# EAGLE design expander16 (EAGLE 6.1)
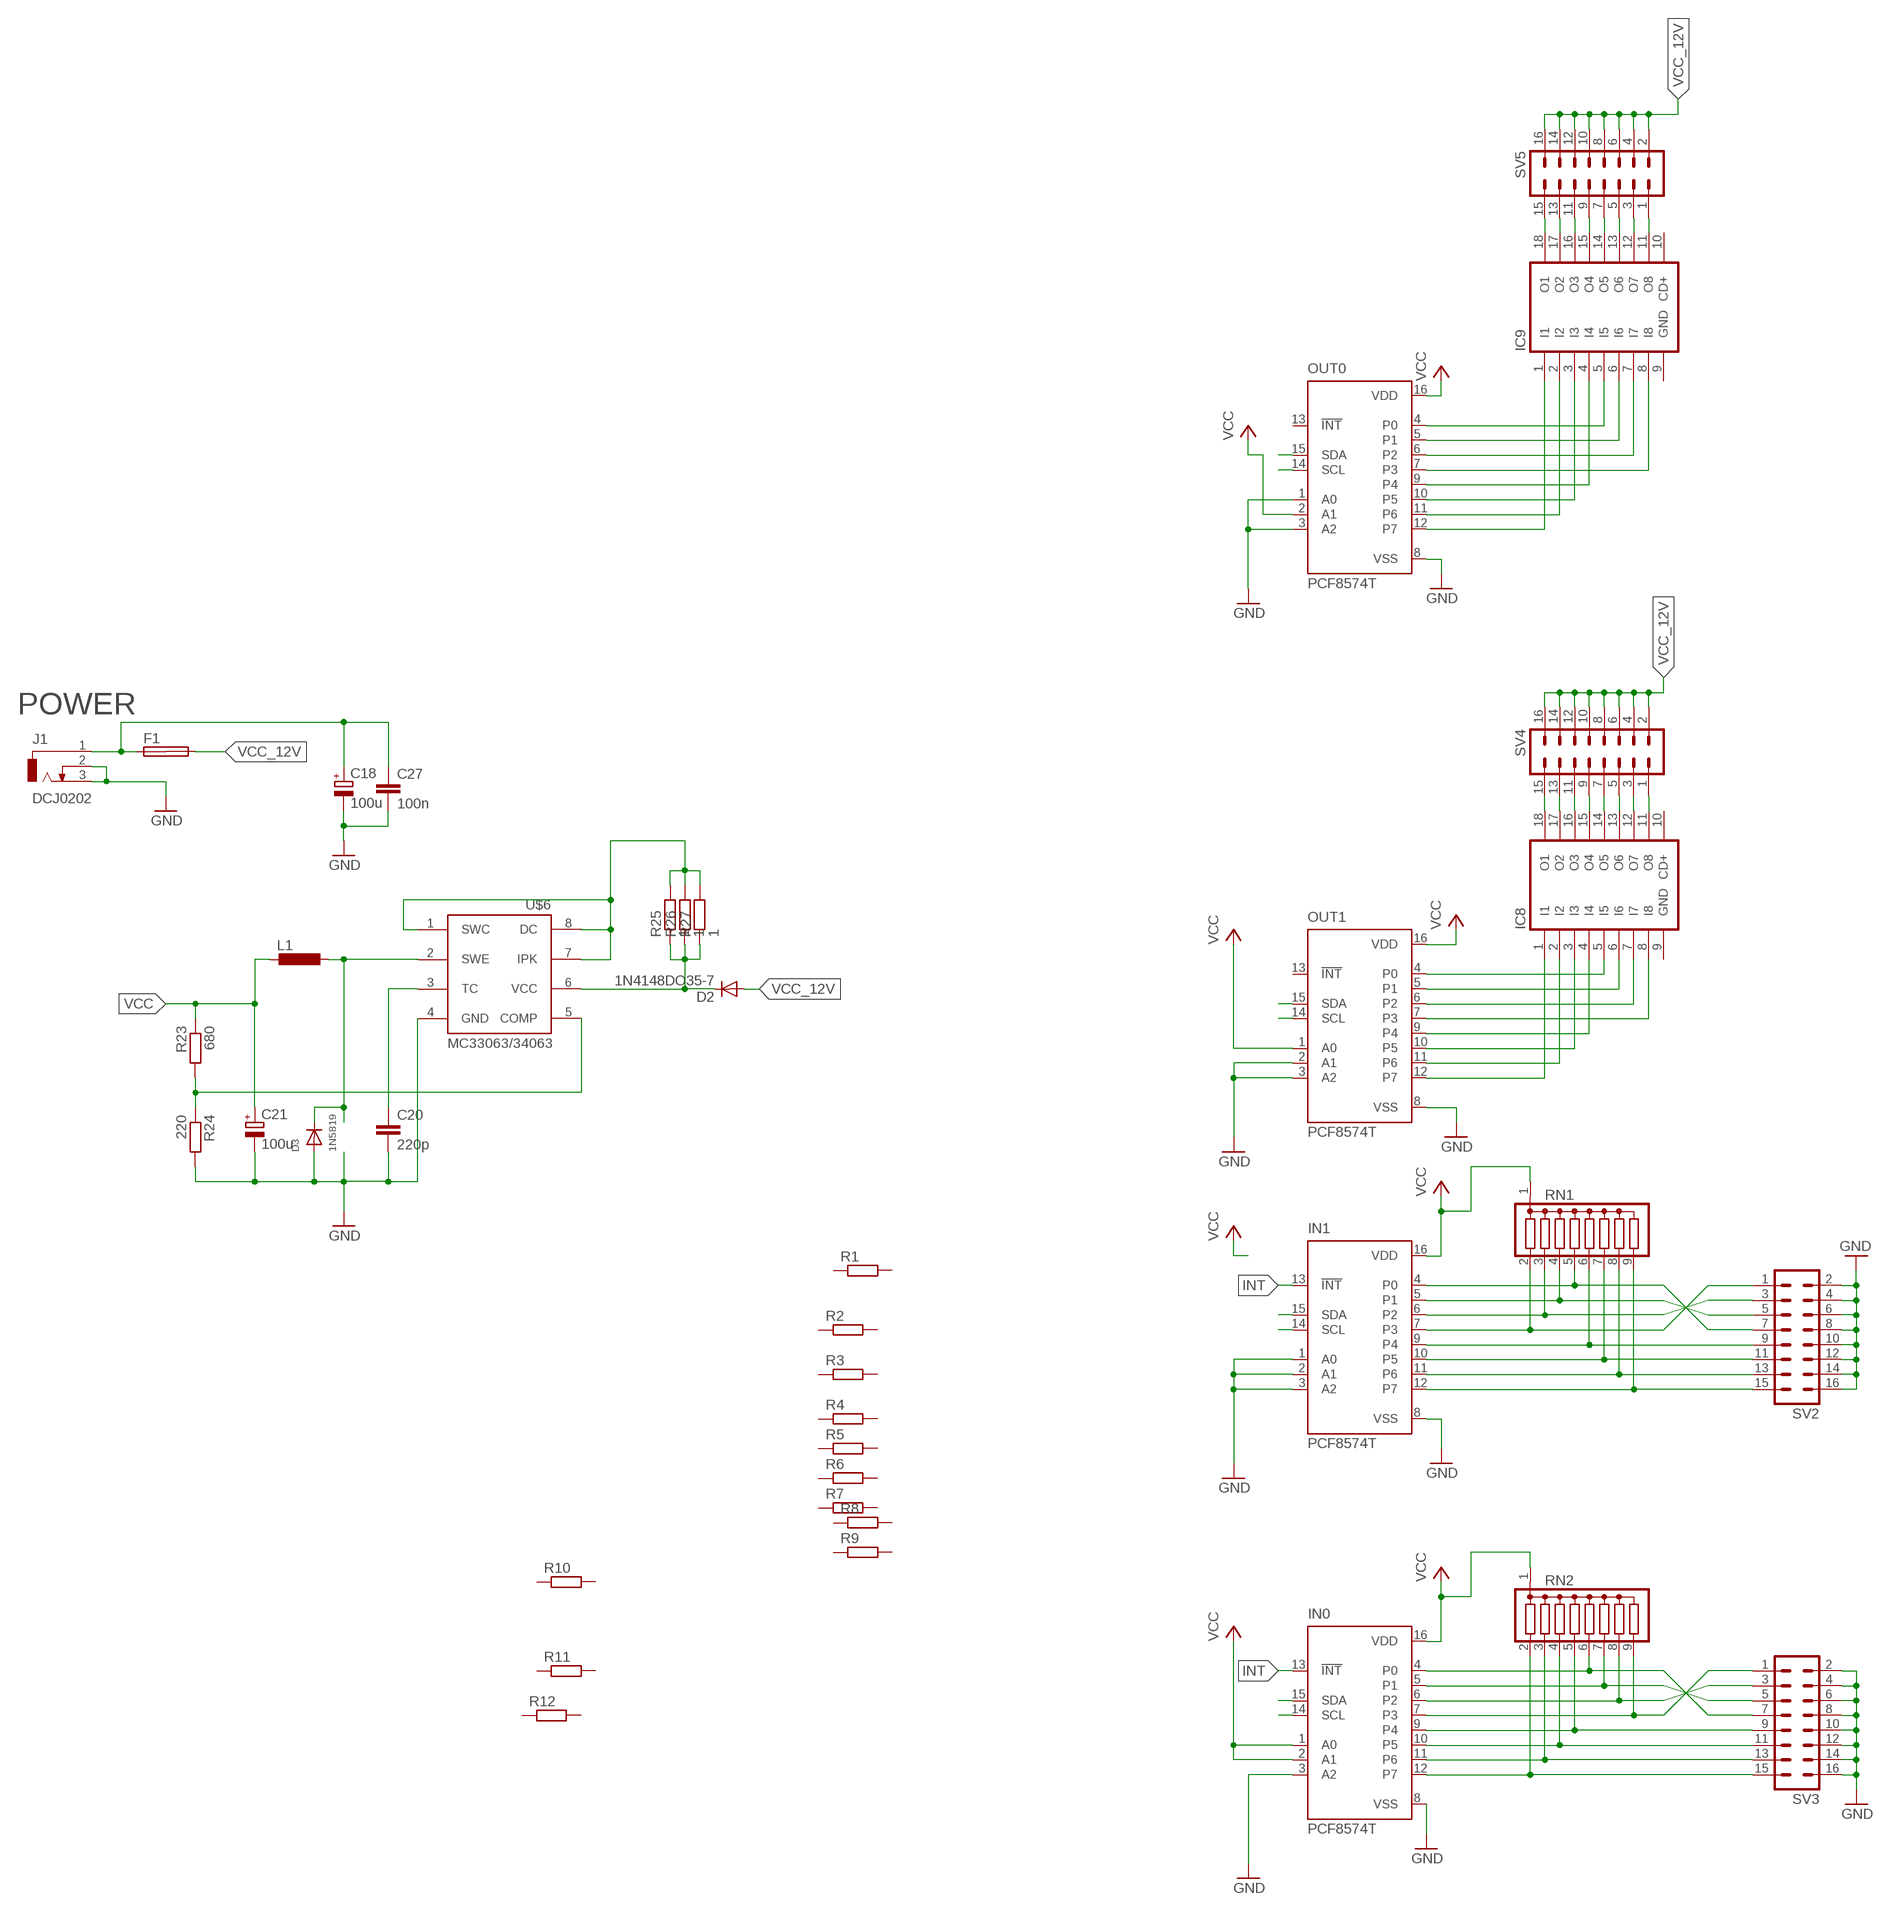
[diagram p0: schematic, sheet 1, part 1 of 3]
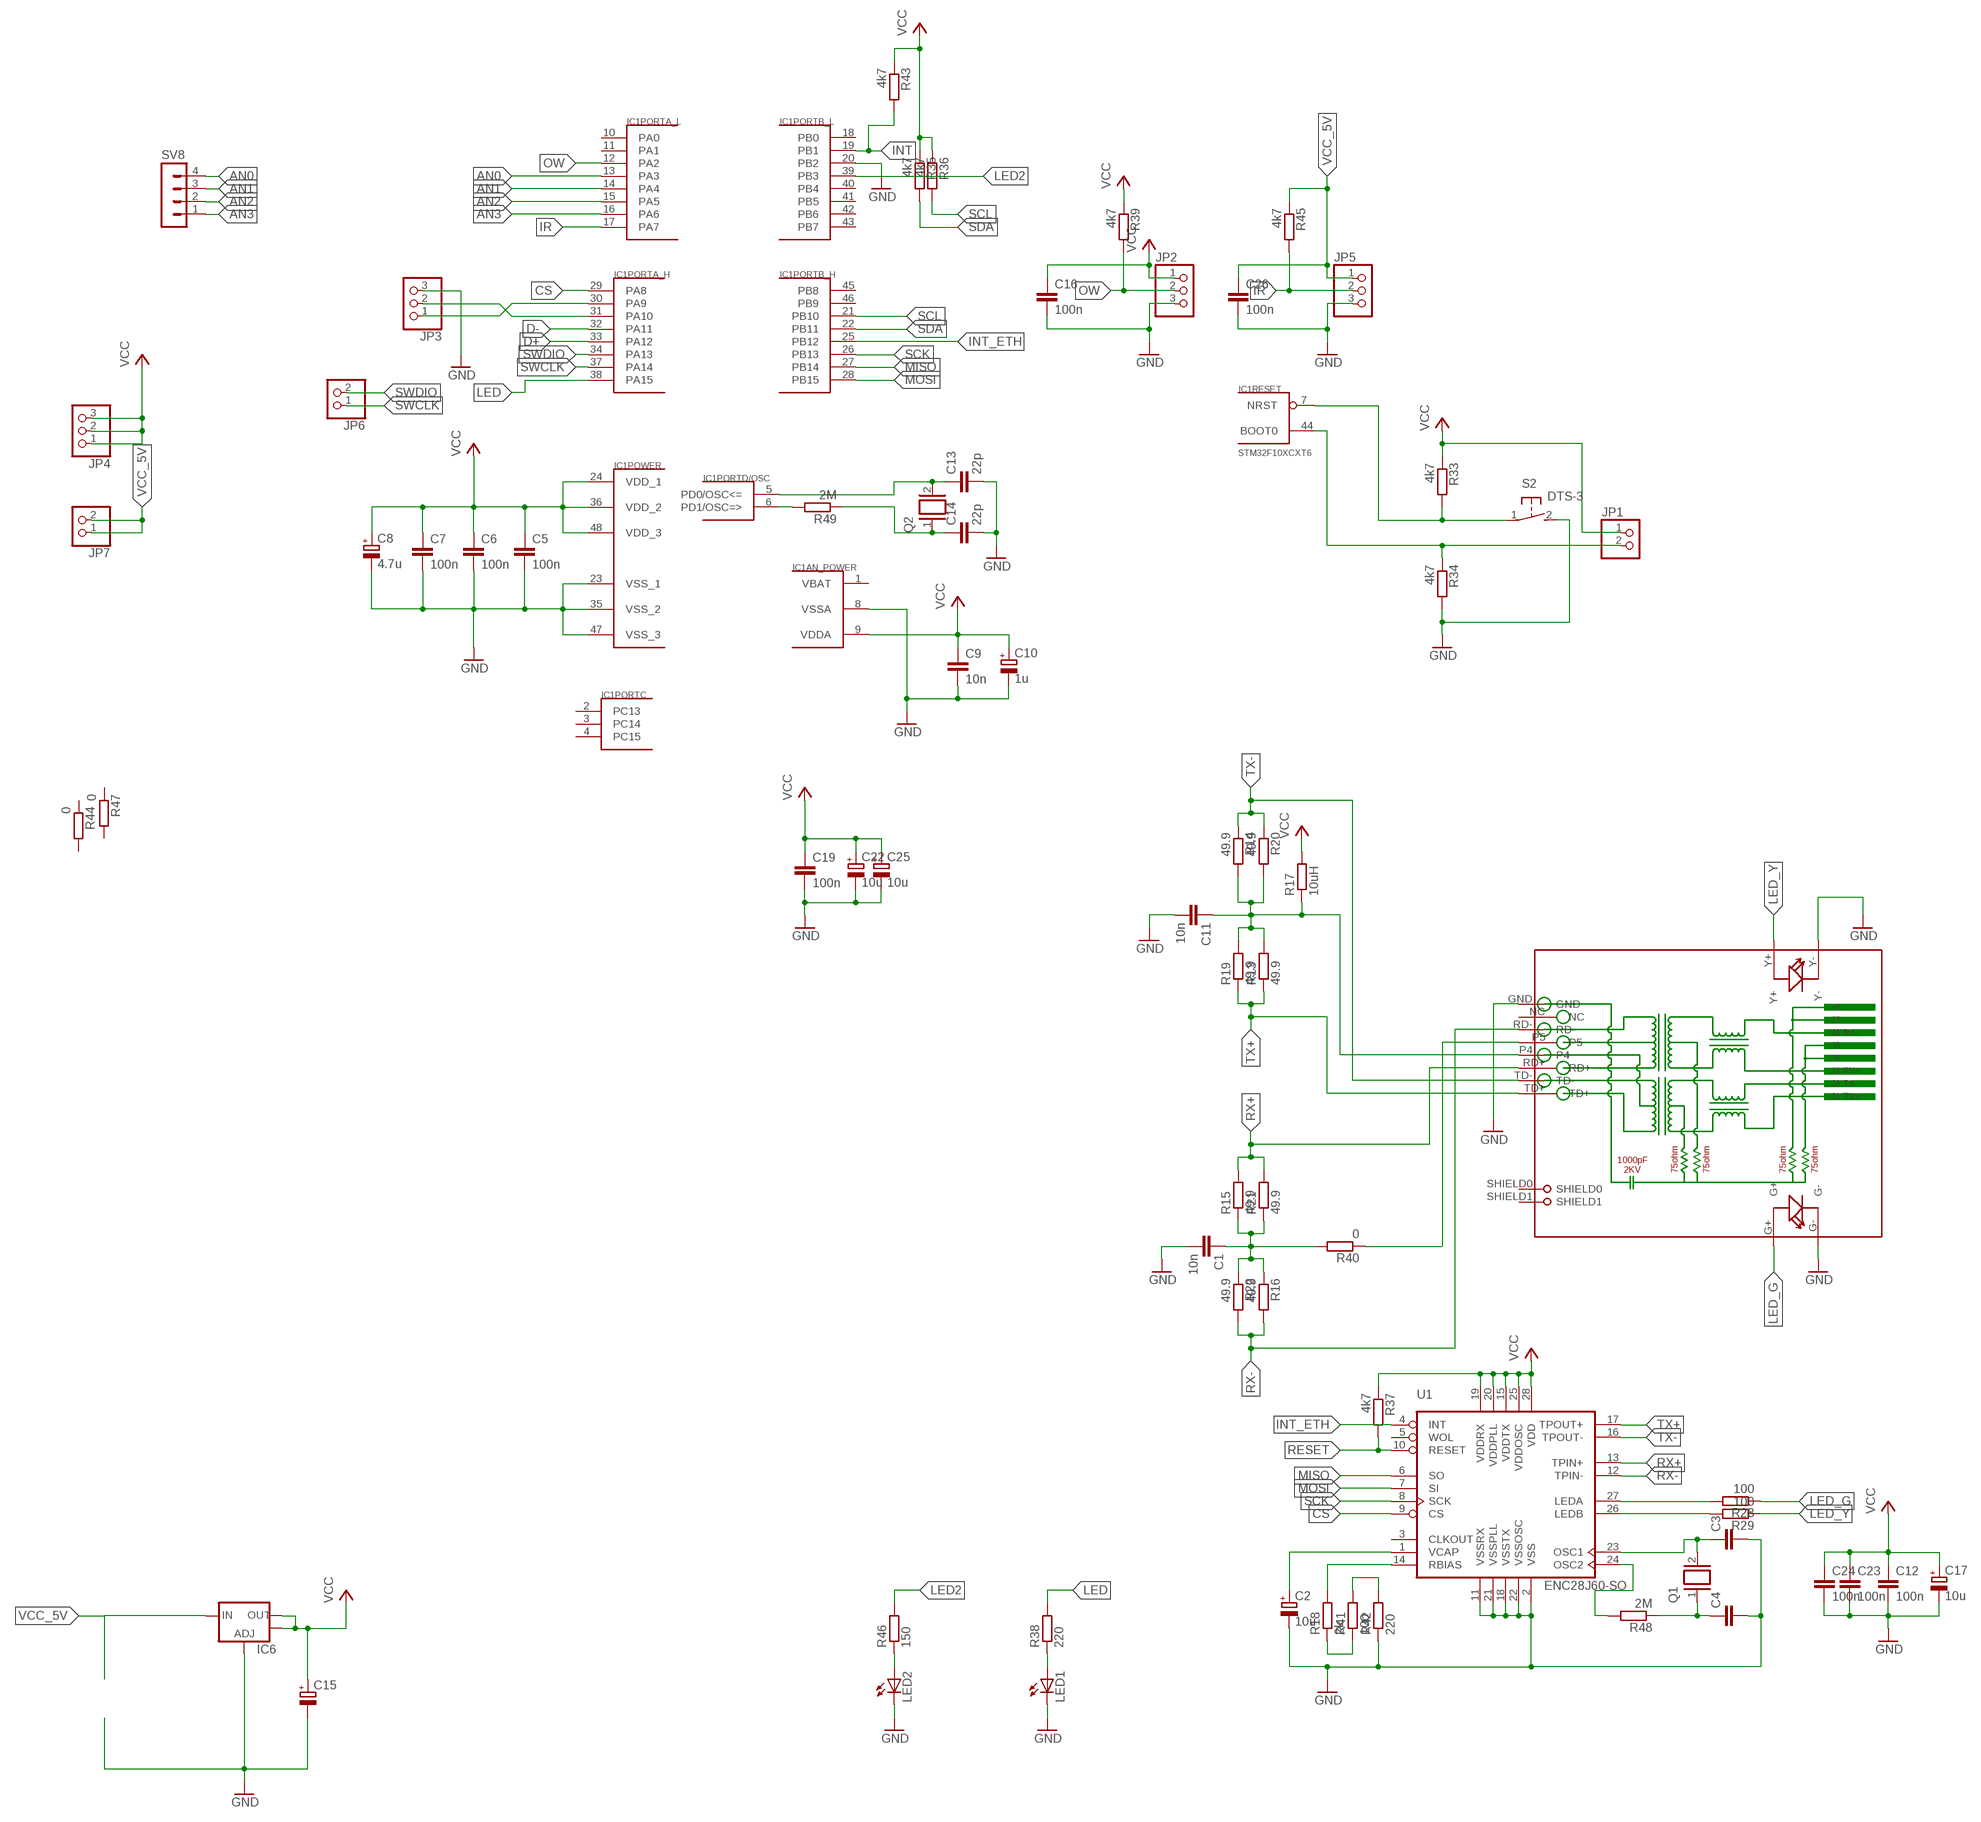
[diagram p1: schematic, sheet 1, part 2 of 3]
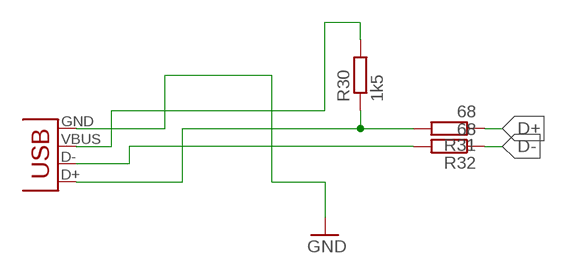
[diagram p2: schematic, sheet 1, part 3 of 3]

## Parts
C1  10n  C-EUC0805  [C0805]
C2  10u  CPOL-EUB/3528-21W  [B/3528-21W]
C3  C-EUC0805  [C0805]
C4  C-EUC0805  [C0805]
C5  100n  C-EUC0805  [C0805]
C6  100n  C-EUC0805  [C0805]
C7  100n  C-EUC0805  [C0805]
C8  4.7u  CPOL-EU153CLV-0505  [153CLV-0505]
C9  10n  C-EUC0805  [C0805]
C10  1u  CPOL-EU153CLV-0505  [153CLV-0505]
C11  10n  C-EUC1206  [C1206]
C12  100n  C-EUC0805  [C0805]
C13  22p  C-EUC0805  [C0805]
C14  22p  C-EUC0805  [C0805]
C15  CPOL-EUA/3216-18R  [A/3216-18R]
C16  100n  C-EUC1206  [C1206]
C17  10u  CPOL-EUE1.8-4  [E1,8-4]
C18  100u  CPOL-EUE2.5-7  [E2,5-7]
C19  100n  C-EUC0805  [C0805]
C20  220p  C-EUC0805  [C0805]
C21  100u  CPOL-EUE3.5-8  [E3,5-8]
C22  10u  CPOL-EUE1.8-4  [E1,8-4]
C23  100n  C-EUC0805  [C0805]
C24  100n  C-EUC0805  [C0805]
C25  10u  CPOL-EUE1.8-4  [E1,8-4]
C26  100n  C-EUC1206  [C1206]
C27  100n  C-EUC0805  [C0805]
D2  1N4148DO35-7  [DO35-7]
D3  1N5819  DIODESMA  [SMADIODE]
F1  SHK20L  [SHK20L]
IC1  STM32F10XCXT6  [TQFP48]
IC6  V_REG_LM1117SOT223  [SOT223]
IC8  ULN2803AD  [SO18W]
IC9  ULN2803AD  [SO18W]
IN0  PCF8574T  [SO16W]
IN1  PCF8574T  [SO16W]
J1  DCJ0202  [DCJ0202]
JP1  PINHD-1X2  [1X02]
JP2  PINHD-1X3  [1X03]
JP3  PINHD-1X3  [1X03]
JP4  PINHD-1X3  [1X03]
JP5  PINHD-1X3  [1X03]
JP6  PINHD-1X2  [1X02]
JP7  PINHD-1X2  [1X02]
L1  L-EU0207/5V  [0207/5V]
LED1  LEDCHIPLED_0805  [CHIPLED_0805]
LED2  LED3MM  [LED3MM]
OUT0  PCF8574T  [SO16W]
OUT1  PCF8574T  [SO16W]
Q1  XTAL/S  [QS]
Q2  XTAL/S  [QS]
R1  R-EU_R1206  [R1206]
R2  R-EU_R1206  [R1206]
R3  R-EU_R1206  [R1206]
R4  R-EU_R1206  [R1206]
R5  R-EU_R1206  [R1206]
R6  R-EU_R1206  [R1206]
R7  R-EU_R1206  [R1206]
R8  R-EU_R1206  [R1206]
R9  R-EU_R1206  [R1206]
R10  R-EU_R1206  [R1206]
R11  R-EU_R1206  [R1206]
R12  R-EU_R1206  [R1206]
R13  49.9  R-EU_R1206  [R1206]
R14  49.9  R-EU_R0805  [R0805]
R15  49.9  R-EU_R1206  [R1206]
R16  49.9  R-EU_R0805  [R0805]
R17  10uH  R-EU_0204/5  [0204/5]
R18  2k  R-EU_R0805  [R0805]
R19  49.9  R-EU_R1206  [R1206]
R20  49.9  R-EU_R0805  [R0805]
R21  49.9  R-EU_R1206  [R1206]
R22  49.9  R-EU_R0805  [R0805]
R23  680  R-EU_M1206  [M1206]
R24  220  R-EU_M1206  [M1206]
R25  1  R-EU_R0805  [R0805]
R26  1  R-EU_R0805  [R0805]
R27  1  R-EU_R0805  [R0805]
R28  100  R-EU_R1206  [R1206]
R29  100  R-EU_R1206  [R1206]
R30  1k5  R-EU_M0805  [M0805]
R31  68  R-EU_M1206  [M1206]
R32  68  R-EU_M1206  [M1206]
R33  4k7  R-EU_R0805  [R0805]
R34  4k7  R-EU_R0805  [R0805]
R35  4k7  R-EU_R0805  [R0805]
R36  4k7  R-EU_R1206  [R1206]
R37  4k7  R-EU_R0805  [R0805]
R38  220  R-EU_R0805  [R0805]
R39  4k7  R-EU_R0805  [R0805]
R40  0  R-EU_R0805  [R0805]
R41  100  R-EU_R0805  [R0805]
R42  220  R-EU_R0805  [R0805]
R43  4k7  R-EU_R0805  [R0805]
R44  0  R-EU_R1206  [R1206]
R45  4k7  R-EU_R0805  [R0805]
R46  150  R-EU_R0805  [R0805]
R47  0  R-EU_R1206  [R1206]
R48  2M  R-EU_R0805  [R0805]
R49  2M  R-EU_R0805  [R0805]
RJ1  HR911105A  [HR911105A]
RN1  G08R  [SIL9]
RN2  G08R  [SIL9]
S2  DTS-3  [DTS-3]
SV2  MA08-2W  [MA08-2W]
SV3  MA08-2W  [MA08-2W]
SV4  MA08-2W  [MA08-2W]
SV5  MA08-2W  [MA08-2W]
SV8  MA04-1  [MA04-1]
U1  ENC28J60-SO  [SO28W]
U$6  MC33063/MC34063D  [SO08]
X1  USBPTH  [USB-B-PTH]

## Nets
AN0: IC1.13(PORTA_L:PA3) SV8.4
AN1: IC1.14(PORTA_L:PA4) SV8.3
AN2: IC1.15(PORTA_L:PA5) SV8.2
AN3: IC1.16(PORTA_L:PA6) SV8.1
COMP: R23.2 R24.1 U$6.5(COMP)
CS: IC1.29(PORTA_H:PA8) U1.9(CS)
D+: IC1.33(PORTA_H:PA12) R31.1
D-: IC1.32(PORTA_H:PA11) R32.1
GND: C1.2 C2.- C3.2 C4.2 C5.2 C6.2 C7.2 C8.- C9.2 C10.- C11.2 C12.2 C13.2 C14.2 C15.- C16.2 C17.- C18.- C19.2 C20.2 C21.- C22.- C23.2 C24.2 C25.- C26.2 C27.2 D3.A IC1.8(AN_POWER:VSSA) IC1.20(PORTB_L:PB2) IC1.23(POWER:VSS_1) IC1.35(POWER:VSS_2) IC1.47(POWER:VSS_3) IC6.1(ADJ) IN0.3(A2) IN0.8(VSS) IN1.1(A0) IN1.2(A1) IN1.3(A2) IN1.8(VSS) J1.2 J1.3 JP2.3 JP3.3 JP5.3 LED1.C LED2.K(C) OUT0.1(A0) OUT0.3(A2) OUT0.8(VSS) OUT1.2(A1) OUT1.3(A2) OUT1.8(VSS) R24.2 R34.2 R42.1 RJ1.G- RJ1.GND RJ1.Y- S2.2 SV2.2 SV2.4 SV2.6 SV2.8 SV2.10 SV2.12 SV2.14 SV2.16 SV3.2 SV3.4 SV3.6 SV3.8 SV3.10 SV3.12 SV3.14 SV3.16 U1.2(VSS) U1.11(VSSRX) U1.18(VSSTX) U1.21(VSSPLL) U1.22(VSSOSC) U$6.4(GND) X1.GND
INT: IC1.19(PORTB_L:PB1) IN0.13(!INT) IN1.13(!INT) R43.2
INT_ETH: IC1.25(PORTB_H:PB12) U1.4(INT)
IPK: R25.2 R26.2 R27.2 U$6.1(SWC) U$6.7(IPK) U$6.8(DC)
IR: IC1.17(PORTA_L:PA7) JP5.2 R45.2
LED: IC1.38(PORTA_H:PA15) R38.2
LED2: IC1.39(PORTB_L:PB3) R46.2
LED_G: R28.1 RJ1.G+
LED_Y: R29.1 RJ1.Y+
MISO: IC1.27(PORTB_H:PB14) U1.6(SO)
MOSI: IC1.28(PORTB_H:PB15) U1.7(SI)
N$1: IC8.18(O1) SV4.15
N$2: IN1.5(P1) RN1.4 SV2.5
N$3: IN1.6(P2) RN1.3 SV2.3
N$4: IN1.7(P3) RN1.2 SV2.1
N$5: IN1.11(P6) RN1.8 SV2.13
N$6: IN1.12(P7) RN1.9 SV2.15
N$7: IN1.10(P5) RN1.7 SV2.11
N$8: IN1.9(P4) RN1.6 SV2.9
N$9: IN0.12(P7) RN2.2 SV3.15
N$10: IN0.11(P6) RN2.3 SV3.13
N$11: IN0.10(P5) RN2.4 SV3.11
N$12: IN0.9(P4) RN2.5 SV3.9
N$13: IN0.7(P3) RN2.9 SV3.1
N$14: IN1.4(P0) RN1.5 SV2.7
N$15: IC8.17(O2) SV4.13
N$16: IN0.4(P0) RN2.6 SV3.7
N$17: IC8.5(I5) OUT1.4(P0)
N$18: IC8.6(I6) OUT1.5(P1)
N$19: IC8.7(I7) OUT1.6(P2)
N$20: IC8.8(I8) OUT1.7(P3)
N$21: IC8.4(I4) OUT1.9(P4)
N$22: IC8.3(I3) OUT1.10(P5)
N$23: IC8.2(I2) OUT1.11(P6)
N$24: IC8.1(I1) OUT1.12(P7)
N$25: IC8.16(O3) SV4.11
N$26: IN0.5(P1) RN2.7 SV3.5
N$27: IN0.6(P2) RN2.8 SV3.3
N$28: IC8.15(O4) SV4.9
N$29: IC8.14(O5) SV4.7
N$30: IC8.13(O6) SV4.5
N$31: IC8.12(O7) SV4.3
N$32: IC8.11(O8) SV4.1
N$33: IC9.1(I1) OUT0.12(P7)
N$34: IC9.2(I2) OUT0.11(P6)
N$35: IC9.3(I3) OUT0.10(P5)
N$36: IC9.4(I4) OUT0.9(P4)
N$37: IC9.8(I8) OUT0.7(P3)
N$38: IC9.7(I7) OUT0.6(P2)
N$39: IC9.6(I6) OUT0.5(P1)
N$40: IC9.5(I5) OUT0.4(P0)
N$41: IC9.11(O8) SV5.1
N$42: IC9.12(O7) SV5.3
N$43: IC9.13(O6) SV5.5
N$44: IC9.14(O5) SV5.7
N$45: IC9.15(O4) SV5.9
N$46: IC9.16(O3) SV5.11
N$47: IC9.17(O2) SV5.13
N$48: IC9.18(O1) SV5.15
N$49: C11.1 R13.2 R14.2 R17.1 R19.2 R20.2 RJ1.P4
N$50: R18.2 U1.14(RBIAS)
N$51: D3.C L1.1 U$6.2(SWE)
N$52: C2.+ U1.1(VCAP)
N$53: C3.1 Q1.2 U1.23(OSC1)
N$54: R28.2 U1.27(LEDA)
N$55: R48.2 U1.24(OSC2)
N$56: C20.1 U$6.3(TC)
N$57: C18.+ C27.1 F1.1A J1.1
N$58: R29.2 U1.26(LEDB)
N$59: R30.1 R31.2 X1.D+
N$60: R32.2 X1.D-
N$61: C13.1 IC1.5(PORTD/OSC:PD0/OSC<=) Q2.2
N$62: C14.1 Q2.1 R49.1
N$63: R40.1 RJ1.P5
N$64: IC1.44(RESET:BOOT0) JP1.2 R34.1
N$65: LED1.A R38.1
N$66: C1.1 R15.1 R16.1 R21.1 R22.1 R40.2
N$67: R18.1 R41.1
N$68: R41.2 R42.2
N$69: LED2.A R46.1
N$83: IC1.6(PORTD/OSC:PD1/OSC=>) R49.2
N$84: C4.1 Q1.1 R48.1
OW: IC1.12(PORTA_L:PA2) JP2.2 R39.2
RESET: R37.2 U1.10(RESET)
RST1: IC1.7(RESET:NRST) R33.2 S2.1
RX: IC1.31(PORTA_H:PA10) JP3.2
RX+: R15.2 R21.2 RJ1.RD+ U1.13(TPIN+)
RX-: R16.2 R22.2 RJ1.RD- U1.12(TPIN-)
SCK: IC1.26(PORTB_H:PB13) U1.8(SCK)
SCL: IC1.21(PORTB_H:PB10) IN0.14(SCL) IN1.14(SCL) OUT0.14(SCL) OUT1.14(SCL) R36.2
SDA: IC1.22(PORTB_H:PB11) IN0.15(SDA) IN1.15(SDA) OUT0.15(SDA) OUT1.15(SDA) R35.2
SWCLK: IC1.37(PORTA_H:PA14) JP6.1
SWDIO: IC1.34(PORTA_H:PA13) JP6.2
TX: IC1.30(PORTA_H:PA9) JP3.1
TX+: R13.1 R19.1 RJ1.TD+ U1.17(TPOUT+)
TX-: R14.1 R20.1 RJ1.TD- U1.16(TPOUT-)
VBUS: R30.2 X1.VBUS
VCC: C5.1 C6.1 C7.1 C8.+ C9.1 C10.+ C12.1 C15.+ C16.1 C17.+ C19.1 C21.+ C22.+ C23.1 C24.1 C25.+ IC1.9(AN_POWER:VDDA) IC1.24(POWER:VDD_1) IC1.36(POWER:VDD_2) IC1.48(POWER:VDD_3) IC6.2(OUT) IC6.4(OUT) IN0.1(A0) IN0.2(A1) IN0.16(VDD) IN1.16(VDD) JP1.1 JP2.1 JP4.1 JP4.2 JP4.3 L1.2 OUT0.2(A1) OUT0.16(VDD) OUT1.1(A0) OUT1.16(VDD) R17.2 R23.1 R33.1 R35.1 R36.1 R37.1 R39.1 R43.1 RN1.1 RN2.1 U1.15(VDDTX) U1.19(VDDRX) U1.20(VDDPLL) U1.25(VDDOSC) U1.28(VDD)
VCC_5V: C26.1 IC6.3(IN) JP5.1 JP7.1 JP7.2 R45.1
VCC_12V: D2.A F1.2A SV4.2 SV4.4 SV4.6 SV4.8 SV4.10 SV4.12 SV4.14 SV4.16 SV5.2 SV5.4 SV5.6 SV5.8 SV5.10 SV5.12 SV5.14 SV5.16
VCC_12V_D: D2.C R25.1 R26.1 R27.1 U$6.6(VCC)
Unconnected: F1.1B F1.2B IC1.2(PORTC:PC13) IC1.3(PORTC:PC14) IC1.4(PORTC:PC15) IC1.10(PORTA_L:PA0) IC1.11(PORTA_L:PA1) IC1.18(PORTB_L:PB0) IC1.40(PORTB_L:PB4) IC1.41(PORTB_L:PB5) IC1.42(PORTB_L:PB6) IC1.43(PORTB_L:PB7) IC1.45(PORTB_H:PB8) IC1.46(PORTB_H:PB9) IC8.10(CD+) IC9.10(CD+) OUT0.13(!INT) OUT1.13(!INT) R1.1 R1.2 R2.1 R2.2 R3.1 R3.2 R4.1 R4.2 R5.1 R5.2 R6.1 R6.2 R7.1 R7.2 R8.1 R8.2 R9.1 R9.2 R10.1 R10.2 R11.1 R11.2 R12.1 R12.2 R44.1 R44.2 R47.1 R47.2 RJ1.NC RJ1.SHIELD0 RJ1.SHIELD1 U1.3(CLKOUT) U1.5(WOL)

## Notes on the sheet
- POWER

## Power pins joined to a net without a drawn wire
GND: IC8.9(GND) IC9.9(GND)
VBAT: IC1.1(AN_POWER:VBAT)

## Library data of the parts
C1 C3 C4 C11 C16 C26 = resistor:C-EU: CAPACITOR, European symbol
C2 C17 C22 C25 = resistor:CPOL-EU: POLARIZED CAPACITOR, European symbol
C5-C7 C9 C12-C14 C19 C20 C23 C24 C27 = rcl-kd:C-EU: CAPACITOR, European symbol
C8 C10 C15 C18 C21 = rcl-kd:CPOL-EU: POLARIZED CAPACITOR, European symbol
D2 = diode:1N4148: DIODE high speed (Philips)
D3 = adafruit:DIODE: Diode SMADIODE - SMA Surface Mount Package 20V 1A Schottky Diode Digikey: 641-1014-6-ND DO-1N4148 - Through Hole Small Current Diode SOD-123 20V 1 A (.5mV Vf) Schottky Diode - Digikey: MBRX120TPMSCT-ND SOD-323 10V 570mA (.38mV Vf, 3ns) Schottky Diode - Digikey: ZLLS410CT-ND SOD-523 30V 30mA Schottky Diode (RB751S-40TE61) - Digikey: RB751S-40TE61CT-ND SOT23-R/W - SOT23 Package (R = Solder Paste/Reflow Ovens, W = Hand-Soldering) BAT54Film 40V 300mA - Digikey: 497-7162-1-ND
F1 = fuse:SHK20L: FUSE HOLDER 5 x 20 mm, SH contact, SHH1 Schukat, E1073 Buerklin; OC_FARNELL: unknown; OC_NEWARK: unknown
IC1 = stm32:STM32F10XCXT6: ST STM32F101/103 48pin LQFP
IC6 = SparkFun:V_REG_LM1117: Voltage Regulator LM1117 Standard adjustable voltage regulator but in SMD form. Spark Fun Electronics SKU : COM-00595
IC8 IC9 = uln-udn:ULN2803A: DRIVER ARRAY
IN0 IN1 OUT0 OUT1 = micro-philips:PCF8574: I2C-Bus Remote 8-bit I/O expander http://www.semiconductors.philips.com/acrobat_download/datasheets/PCF8574_4.pdf; MPN: PCF8574T/3,512; OC_FARNELL: 1201255; OC_NEWARK: 70R6870
J1 = con-jack:DCJ0202: DC POWER JACK Source: DCJ0202.pdf; OC_FARNELL: unknown; OC_NEWARK: unknown
JP1 = pinhead-kd:PINHD-1X2: PIN HEADER
JP2-JP5 = pinhead:PINHD-1X3: PIN HEADER
JP6 JP7 = pinhead:PINHD-1X2: PIN HEADER
L1 = rcl-kd:L-EU: INDUCTOR, European symbol
LED1 LED2 = adafruit:LED: LED OSRAM: - CHIPLED LG R971, LG N971, LY N971, LG Q971, LY Q971, LO R971, LY R971 LH N974, LH R974 LS Q976, LO Q976, LY Q976 LO Q996 - Hyper CHIPLED LW Q18S LB Q993, LB Q99A, LB R99A - SideLED LS A670, LO A670, LY A670, LG A670, LP A670 LB A673, LV A673, LT A673, LW A673 LH A674 LY A675 LS A676, LA A676, LO A676, LY A676, LW A676 LS A679, LY A679, LG A679 - Hyper Micro SIDELED® LS Y876, LA Y876, LO Y876, LY Y876 LT Y87S - SmartLED LW L88C, LW L88S LB L89C, LB L89S, LG L890 LS L89K, LO L89K, LY L89K LS L896, LA L896, LO L896, LY L896 - TOPLED LS T670, LO T670, LY T670, LG T670, LP T670 LSG T670, LSP T670, LSY T670, LOP T670, LYG T670 LG T671, LOG T671, LSG T671 LB T673, LV T673, LT T673, LW T673 LH T674 LS T676, LA T676, LO T676, LY T676, LB T676, LH T676, LSB T676, LW T676 LB T67C, LV T67C, LT T67C, LS T67K, LO T67K, LY T67K, LW E67C LS E67B, LA E67B, LO E67B, LY E67B, LB E67C, LV E67C, LT E67C LW T67C LS T679, LY T679, LG T679 LS T770, LO T770, LY T770, LG T770, LP T770 LB T773, LV T773, LT T773, LW T773 LH T774 LS E675, LA E675, LY E675, LS T675 LS T776, LA T776, LO T776, LY T776, LB T776 LHGB T686 LT T68C, LB T68C - Hyper Mini TOPLED® LB M676 - Mini TOPLED Santana® LG M470 LS M47K, LO M47K, LY M47K Source: http://www.osram.convergy.de/
Q1 Q2 = special:XTAL/S: CRYSTAL
R1-R22 R28 R29 R35-R49 = resistor:R-EU_: RESISTOR, European symbol
R23 R24 = rcl:R-EU_: RESISTOR, European symbol
R25-R27 R30-R34 = rcl-kd:R-EU_: RESISTOR, European symbol
RJ1 = CONNECTER:HR911105A
RN1 RN2 = resistor-sil:G08R: SIL RESISTOR; OC_FARNELL: unknown; OC_NEWARK: unknown
S2 = switch-tact:DTS-3
SV2-SV5 = con-lstb:MA08-2W: PIN HEADER; OC_FARNELL: unknown; OC_NEWARK: unknown
SV8 = con-lstb:MA04-1: PIN HEADER; OC_FARNELL: unknown; OC_NEWARK: unknown
U1 = microchip-enc28j60:ENC28J60-*: Microchip 10Mbit Eth. contoller with SPI interface
U$6 = adafruit:MC33063/MC34063: MC33063 and MC34063 Basic DC/DC converter with internal power-NPN transistor, 100KHz, 1.5A peak switch current. 3-40 input/output.
X1 = SparkFun:USB: USB Connectors USB-B-PTH is fully proven SKU : PRT-00139 USB-miniB is fully proven SKU : PRT-00587 USB-A-PCB is untested. USB-A-H is throughly reviewed, but untested. Spark Fun Electronics SKU : PRT-00437 USB-B-SMT is throughly reviewed, but untested. Needs silkscreen touching up. USB-A-S has not been used/tested USB-MB-H has not been used/tested

## Board
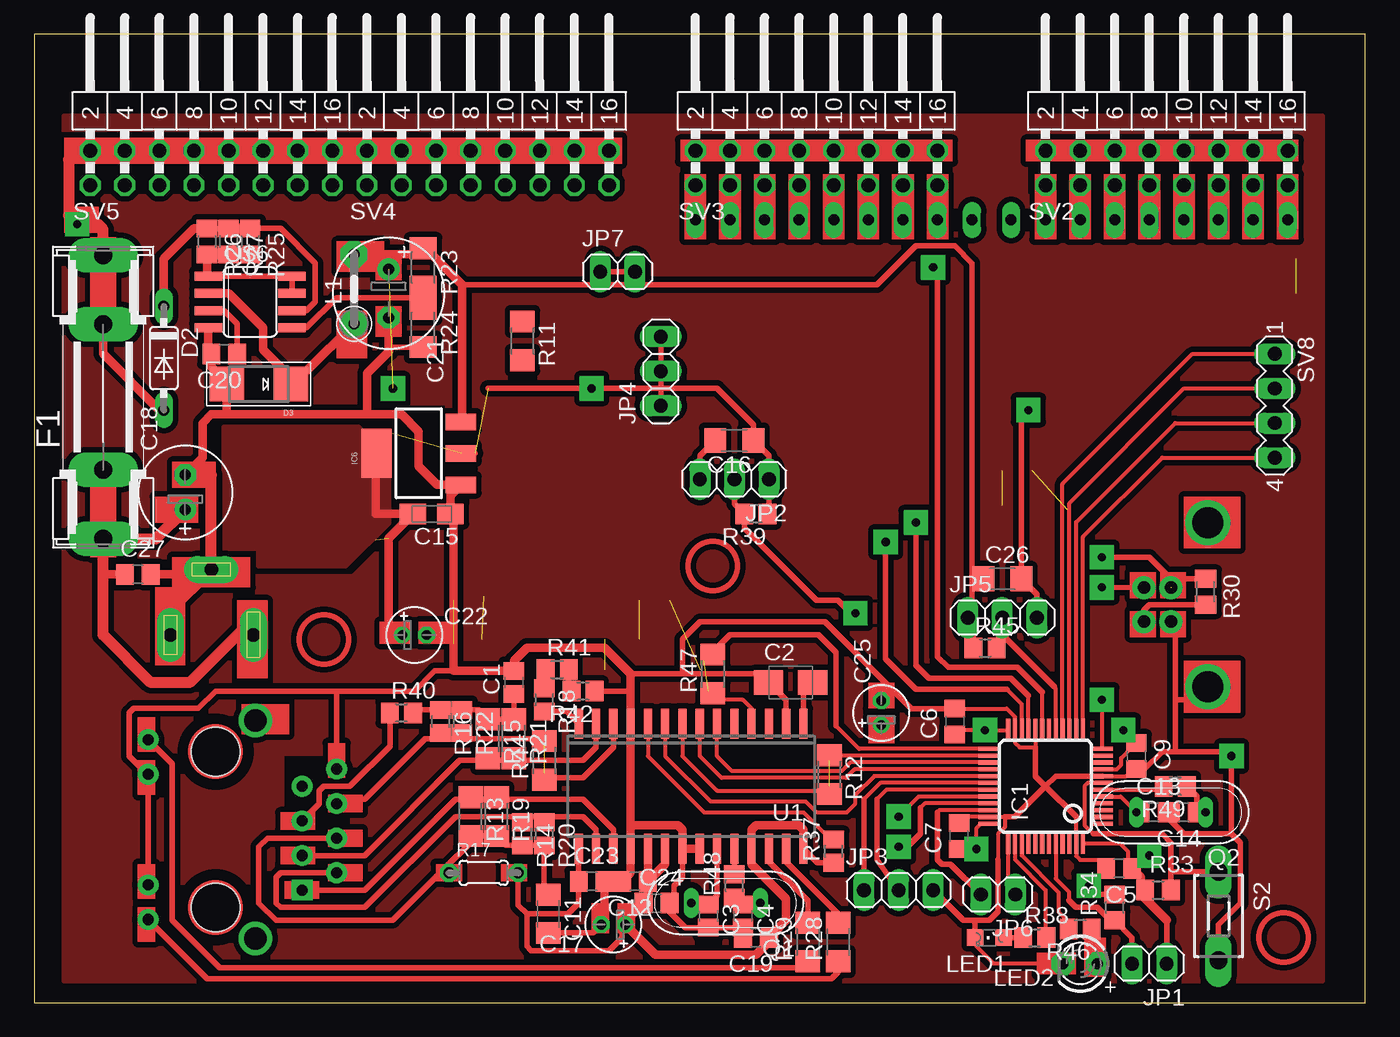
[diagram p3: board, top side]
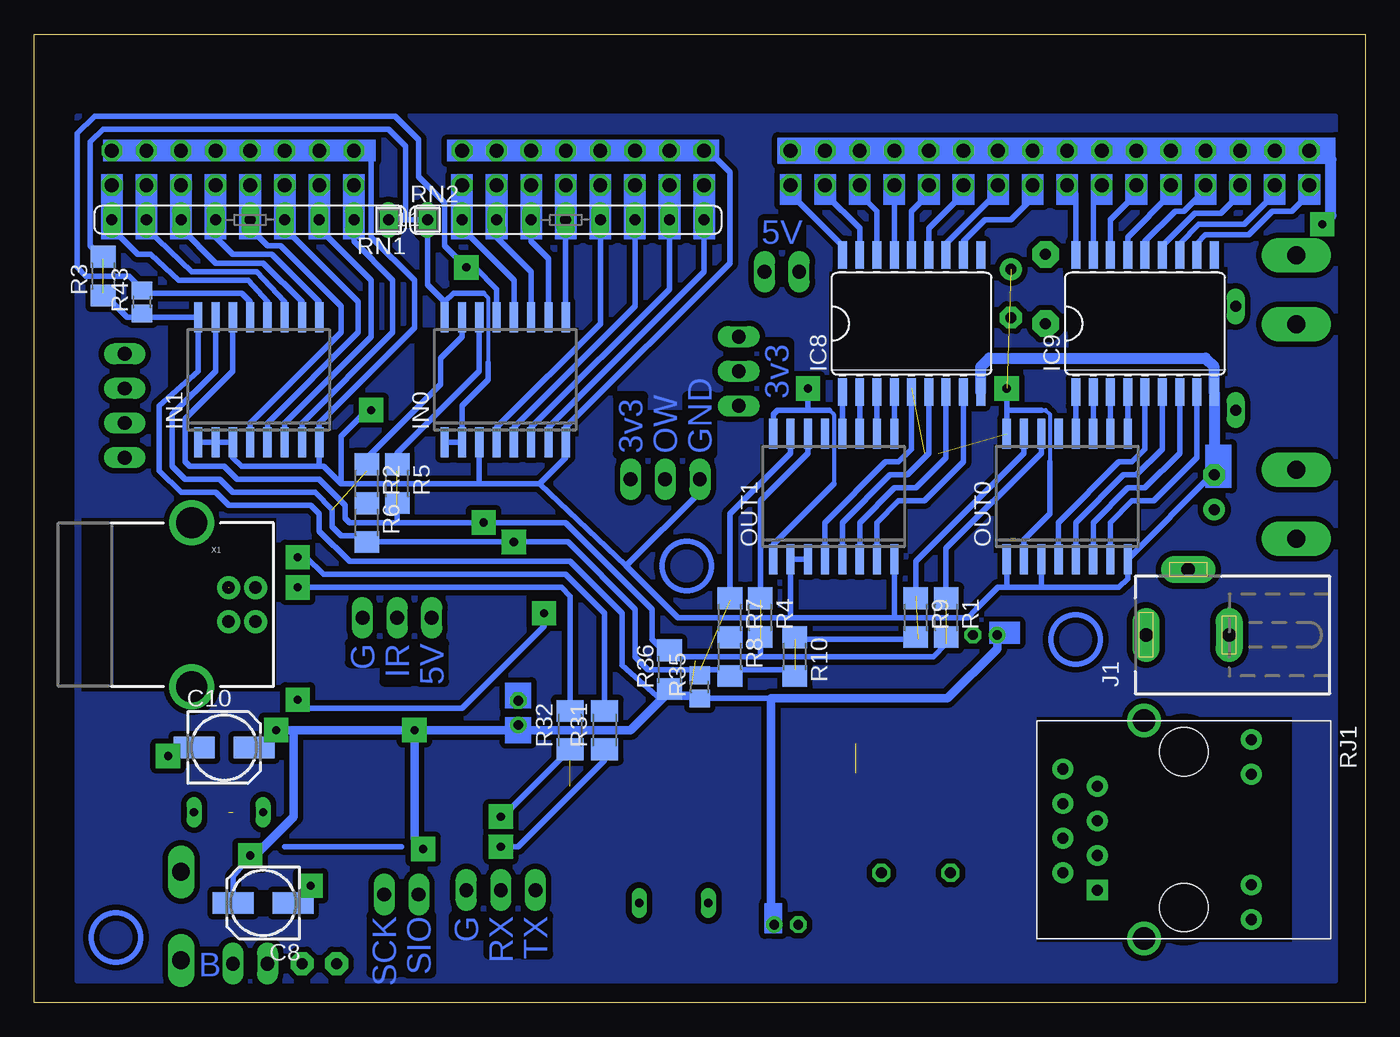
[diagram p4: board, bottom side, seen from below]

Size 97.79 x 71.11 mm. Coordinates in mm from the lower left corner, seen from the top.
Outline: 0,0 97.79,0 97.79,71.11 0,71.11 0,0
Copper layers (1*16): Top 0.035mm / dielectric 1.5mm / Bottom 0.035mm
Design rules: minimum track width 10mil, minimum drill 24mil, track to track 8mil, track to pad 8mil, pad to pad 8mil, via to via 8mil, smd to smd 8mil, copper to edge 40mil, drill to drill 8mil, minimum pad ring 10mil, minimum via ring 8mil, stop-mask expansion 4mil, vias tented up to drill 0mil, thermal gap 10mil

### Footprints (pad centres in the part's own frame; a part is rotated, then mirrored left to right if it is on the bottom)
C0805 = smd 1.3 x 1.5: 1 -0.85,0; 2 0.85,0
B/3528-21W = smd 2.15 x 1.8: + 1.625,0; - -1.625,0
C0805' = smd 1.3 x 1.5: 1 -0.95,0; 2 0.95,0
153CLV-0505 = smd 3 x 1.6: + 2.2,0; - -2.2,0
C1206 = smd 1.6 x 1.8: 1 -1.4,0; 2 1.4,0
A/3216-18R = smd 1.95 x 1.5: + 1.375,0; - -1.375,0
E1,8-4 = drill 0.711 pad 1.168: + -0.889,0 | drill 0.711 pad 1.168 octagon: - 0.889,0
E2,5-7 = drill 0.813 pad 1.6: + -1.27,0 | drill 0.813 pad 1.6 octagon: - 1.27,0
E3,5-8 = drill 0.813 pad 1.6: + -1.778,0 | drill 0.813 pad 1.6 octagon: - 1.778,0
DO35-7 = drill 0.813 long: A 3.81,0; C -3.81,0
SMADIODE = smd 2.54 x 2.54: A 2.349,0; C -2.349,0
SHK20L = drill 1.321 pad 2.54 long: 1A -10.414,0; 1B -5.334,0; 2A 10.414,0; 2B 5.334,0
TQFP48 = smd 0.305 x 1.524: 1 -2.75,-4.183; 2 -2.25,-4.183; 3 -1.75,-4.183; 4 -1.25,-4.183; 5 -0.75,-4.183; 6 -0.25,-4.183; 7 0.25,-4.183; 8 0.75,-4.183; 9 1.25,-4.183; 10 1.75,-4.183; 11 2.25,-4.183; 12 2.75,-4.183; 25 2.75,4.183; 26 2.25,4.183; 27 1.75,4.183; 28 1.25,4.183; 29 0.75,4.183; 30 0.25,4.183; 31 -0.25,4.183; 32 -0.75,4.183; 33 -1.25,4.183; 34 -1.75,4.183; 35 -2.25,4.183; 36 -2.75,4.183 | smd 1.524 x 0.305: 13 4.183,-2.75; 14 4.183,-2.25; 15 4.183,-1.75; 16 4.183,-1.25; 17 4.183,-0.75; 18 4.183,-0.25; 19 4.183,0.25; 20 4.183,0.75; 21 4.183,1.25; 22 4.183,1.75; 23 4.183,2.25; 24 4.183,2.75; 37 -4.183,2.75; 38 -4.183,2.25; 39 -4.183,1.75; 40 -4.183,1.25; 41 -4.183,0.75; 42 -4.183,0.25; 43 -4.183,-0.25; 44 -4.183,-0.75; 45 -4.183,-1.25; 46 -4.183,-1.75; 47 -4.183,-2.25; 48 -4.183,-2.75
SOT223 = smd 1.219 x 2.235: 1 -2.311,-3.099; 2 0,-3.099; 3 2.311,-3.099 | smd 3.6 x 2.2: 4 0,3.099
SO18W = smd 0.66 x 2.032: 1 -5.08,-5.029; 2 -3.81,-5.029; 3 -2.54,-5.029; 4 -1.27,-5.029; 5 0,-5.029; 6 1.27,-5.029; 7 2.54,-5.029; 8 3.81,-5.029; 9 5.08,-5.029; 10 5.08,5.029; 11 3.81,5.029; 12 2.54,5.029; 13 1.27,5.029; 14 0,5.029; 15 -1.27,5.029; 16 -2.54,5.029; 17 -3.81,5.029; 18 -5.08,5.029
SO16W = smd 0.6 x 2.2: 1 -4.445,-4.6; 2 -3.175,-4.6; 3 -1.905,-4.6; 4 -0.635,-4.6; 5 0.635,-4.6; 6 1.905,-4.6; 7 3.175,-4.6; 8 4.445,-4.6; 9 4.445,4.6; 10 3.175,4.6; 11 1.905,4.6; 12 0.635,4.6; 13 -0.635,4.6; 14 -1.905,4.6; 15 -3.175,4.6; 16 -4.445,4.6
DCJ0202 = drill 1 pad 2 long: 1 0,3.1; 2 4.8,0; 3 0,-3
1X02 = drill 1.016 long: 1 -1.27,0; 2 1.27,0
1X03 = drill 1.016 long: 1 -2.54,0; 2 0,0; 3 2.54,0
0207/5V = drill 0.813 pad 1.93 octagon: 1 -2.54,0; 2 2.54,0
CHIPLED_0805 = smd 1.2 x 1.2: A 0,-1.05; C 0,1.05
LED3MM = drill 0.813 pad 1.676 octagon: A -1.27,0; K 1.27,0
QS = drill 0.61 long: 1 -2.54,0; 2 2.54,0
R1206 = smd 1.6 x 1.803: 1 -1.422,0; 2 1.422,0
R0805 = smd 1.3 x 1.5: 1 -0.85,0; 2 0.85,0
0204/5 = drill 0.813 octagon: 1 -2.54,0; 2 2.54,0
M1206 = smd 1.6 x 2: 1 -1.4,0; 2 1.4,0
R0805' = smd 1.3 x 1.5: 1 -0.95,0; 2 0.95,0
M0805 = smd 1.3 x 1.6: 1 -0.95,0; 2 0.95,0
HR911105A = drill 0.813 pad 1.524: G+ 4.953,-6.604; G- 4.953,-4.064; GND -8.89,4.445; NC -6.35,3.175; P4 -8.89,-0.635; P5 -6.35,0.635; RD+ -6.35,-1.905; RD- -8.89,1.905; TD- -8.89,-3.175; Y+ 4.953,6.604; Y- 4.953,4.064 | drill 1.651 pad 2.159: SHIELD0 -2.921,8.001; SHIELD1 -2.921,-8.001 | drill 0.813 pad 1.524 square: TD+ -6.35,-4.445 | hole 3.556: 0,-5.715; 0,5.715
SIL9 = drill 0.813 long: 1 -10.16,0; 2 -7.62,0; 3 -5.08,0; 4 -2.54,0; 5 0,0; 6 2.54,0; 7 5.08,0; 8 7.62,0; 9 10.16,0
DTS-3 = drill 1.3 long: 1 -3.25,0; 2 3.25,0
MA08-2W = drill 1.016 octagon: 1 -8.89,-1.27; 2 -8.89,1.27; 3 -6.35,-1.27; 4 -6.35,1.27; 5 -3.81,-1.27; 6 -3.81,1.27; 7 -1.27,-1.27; 8 -1.27,1.27; 9 1.27,-1.27; 10 1.27,1.27; 11 3.81,-1.27; 12 3.81,1.27; 13 6.35,-1.27; 14 6.35,1.27; 15 8.89,-1.27; 16 8.89,1.27
MA04-1 = drill 1.016 long: 1 -3.81,0; 2 -1.27,0; 3 1.27,0; 4 3.81,0
SO28W = smd 0.6 x 2.2: 1 -8.255,-4.6; 2 -6.985,-4.6; 3 -5.715,-4.6; 4 -4.445,-4.6; 5 -3.175,-4.6; 6 -1.905,-4.6; 7 -0.635,-4.6; 8 0.635,-4.6; 9 1.905,-4.6; 10 3.175,-4.6; 11 4.445,-4.6; 12 5.715,-4.6; 13 6.985,-4.6; 14 8.255,-4.6; 15 8.255,4.6; 16 6.985,4.6; 17 5.715,4.6; 18 4.445,4.6; 19 3.175,4.6; 20 1.905,4.6; 21 0.635,4.6; 22 -0.635,4.6; 23 -1.905,4.6; 24 -3.175,4.6; 25 -4.445,4.6; 26 -5.715,4.6; 27 -6.985,4.6; 28 -8.255,4.6
SO08 = smd 0.66 x 2.032: 1 -1.905,-3.073; 2 -0.635,-3.073; 3 0.635,-3.073; 4 1.905,-3.073; 5 1.905,3.073; 6 0.635,3.073; 7 -0.635,3.073; 8 -1.905,3.073
USB-B-PTH = drill 0.914 pad 1.676: D+ 0,1.25; D- 1.981,1.25; GND 0,-1.25; VBUS 1.981,-1.25 | drill 2.286: S1 -2.718,-6.02; S2 -2.718,6.02

### Placement (x,y rotation side)
C1  35.24,23.5 90 top
C2  55.56,23.5 0 top
C3  49.53,6.35 270 top
C4  52.07,6.35 270 top
C5  100n  [C0805']  79.69,9.84 180 top
C6  100n  [C0805']  67.63,20.64 90 top
C7  100n  [C0805']  67.94,12.22 90 top
C8  80.96,7.3 180 bottom
C9  10n  [C0805']  80.96,18.1 270 top
C10  83.82,18.73 0 bottom
C11  37.78,6.51 270 top
C12  100n  [C0805']  44.13,8.89 180 top
C13  22p  [C0805']  82.23,13.97 0 top
C14  22p  [C0805']  84.45,13.97 180 top
C15  29.21,35.88 180 top
C16  51.44,41.27 180 top
C17  42.55,5.71 180 top
C18  11.11,37.47 90 top
C19  100n  [C0805']  53.02,4.76 180 top
C20  220p  [C0805']  13.97,47.62 180 top
C21  26.04,52.07 270 top
C22  27.94,26.99 0 top
C23  100n  [C0805']  40.96,8.89 0 top
C24  100n  [C0805']  45.72,7.3 0 top
C25  62.23,21.27 90 top
C26  71.12,31.11 0 top
C27  100n  [C0805']  7.62,31.43 0 top
D2  9.53,47.31 270 top
D3  16.51,45.4 180 top
F1  5.08,44.45 90 top
IC1  74.3,15.88 90 top
IC6  28.26,40.32 90 top
IC8  33.34,49.85 0 bottom
IC9  16.19,49.85 0 bottom
IN0  63.18,45.72 0 bottom
IN1  81.28,45.72 0 bottom
J1  13.02,26.99 90 bottom
JP1  81.92,2.86 180 top
JP2  51.44,38.42 180 top
JP3  63.5,8.26 0 top
JP4  46.04,46.35 90 top
JP5  71.12,28.26 0 top
JP6  70.8,7.94 180 top
JP7  42.86,53.66 0 top
L1  23.5,52.39 90 top
LED1  70.17,4.76 90 top
LED2  76.83,2.86 180 top
OUT0  21.91,37.15 0 bottom
OUT1  39.05,37.15 0 bottom
Q1  50.8,7.3 180 top
Q2  83.5,13.97 180 top
R1  30.8,28.26 270 bottom
R2  73.34,38.1 270 bottom
R3  92.71,53.34 90 bottom
R4  44.45,28.26 270 bottom
R5  71.12,38.1 270 bottom
R6  73.34,35.24 270 bottom
R7  46.67,28.26 270 bottom
R8  46.67,25.4 270 bottom
R9  33.02,28.26 270 bottom
R10  41.91,25.4 270 bottom
R11  35.88,48.58 270 top
R12  58.42,16.74 270 top
R13  32.07,13.65 270 top
R14  35.88,12.38 270 top
R15  33.34,19.37 270 top
R16  29.84,20.64 270 top
R17  33.02,9.53 0 top
R18  37.47,22.23 270 top
R19  33.97,13.65 270 top
R20  37.47,12.38 270 top
R21  35.24,19.37 270 top
R22  31.43,20.64 270 top
R23  28.57,53.98 270 top
R24  28.57,49.53 270 top
R25  1  [R0805']  15.88,55.88 270 top
R26  1  [R0805']  12.7,55.88 270 top
R27  1  [R0805']  14.29,55.88 270 top
R28  59.05,4.45 90 top
R29  56.83,4.45 90 top
R30  86.04,30.16 270 top
R31  55.88,20 90 bottom
R32  58.42,20 90 bottom
R33  4k7  [R0805']  82.55,8.26 0 top
R34  4k7  [R0805']  79.38,6.99 90 top
R35  48.9,23.18 90 bottom
R36  51.12,24.45 90 bottom
R37  58.74,11.11 90 top
R38  73.5,4.76 0 top
R39  53.02,35.88 180 top
R40  26.99,21.27 0 top
R41  38.42,24.45 0 top
R42  40.32,22.86 180 top
R43  89.85,51.44 90 bottom
R44  37.47,17.78 90 top
R45  69.85,26.04 0 top
R46  76.83,5.4 180 top
R47  49.85,24.13 90 top
R48  51.44,8.57 90 top
R49  83.82,15.88 180 top
RJ1  13.34,12.7 0 bottom
RN1  81.92,57.47 180 bottom
RN2  58.74,57.47 0 bottom
S2  87,6.35 270 top
SV2  83.19,61.28 0 top
SV3  57.47,61.28 0 top
SV4  33.34,61.28 0 top
SV5  13.02,61.28 0 top
SV8  91.12,43.81 270 top
U1  48.26,15.88 180 top
U$6  15.88,51.44 270 top
X1  83.5,29.21 0 bottom

### Tracks (layer width: path | path; a pad name or v marks a point on that pad's centre or on a via)
AN0
  Top 0.305: IC1.13 77.05,34.18 82.87,40.01 SV8.4
AN1
  Top 0.305: IC1.14 76.55,35.27 83.82,42.55 SV8.3
AN2
  Top 0.305: IC1.15 76.05,36.67 84.45,45.09 SV8.2
AN3
  Top 0.305: IC1.16 75.55,38.08 85.09,47.62 SV8.1
COMP
  Top 0.406: U$6.5 20,49.53 22.23,51.75 28.57,51.75 | R23.2 28.57,51.75 | 28.57,51.75 R24.1
CS
  Top 0.305: U1.9 46.35,18.1 49.69,14.76 56.67,14.76 57.47,13.97 59.69,13.97 60.33,14.61 60.33,15.24 61.71,16.62 IC1.29
D+  (via drill 0.6 pad 1.78)
  Top 0.305: IC1.33 65.42,14.62 65.09,14.29
  Top 0.406: 65.09,14.29 65.09,12.38 64.14,11.43 v63.5,11.43
  Bottom 0.406: v63.5,11.43 62.23,11.43 55.88,17.78 R31.1
D-  (via drill 0.6 pad 1.78)
  Top 0.305: IC1.32 64.97,15.12 v63.5,13.65
  Bottom 0.406: v63.5,13.65 63.5,13.52 R32.1
GND  (via drill 0.6 pad 1.78)  (1 unrouted)
  Top 0.305: 76.55,13.62 IC1.47 76.55,10.77 76.83,10.48 78.11,10.48 C5.2 78.45,10.13 | IC1.20 73.55,18.73 72.39,18.73 72.05,19.08 IC1.23 72.05,20.98 71.44,21.59 C6.2 | IC1.8 80.22,16.62 C9.2 | C7.2 67.97,13.62 IC1.35 71.3,13.62 71.3,12.88 70.8,12.38 70.8,10.48 | LED2.K 70.48,2.86 69.22,4.13 69.22,4.67 LED1.C
  Top 0.406: U1.18 43.81,13.02 | U1.2 55.24,22.23 53.34,24.13 53.02,24.13 | 8,8.64 RJ1.G- RJ1.Y- 8.32,16.76 6.99,18.1 6.99,21.27 7.3,21.59 12.06,21.59 13.34,22.86 22.23,22.86 | 76.55,13.62 74.3,15.88 | 74.3,15.88 73.55,16.62 73.55,18.73 | 71.3,13.62 72.05,13.62 74.3,15.88 | IC1.8 75.05,16.62 74.3,15.88 | C5.2 v77.47,8.57 78.11,7.93 R34.2 | C9.2 81.6,17.15 82.87,18.41 83.82,18.41 | 87.95,12.38 v87.95,18.1 87.63,18.41 83.82,18.41 | 87.95,12.38 84.46,12.38 83.19,13.65 C14.2 | X1.GND 83.5,27.3 83.82,26.99 83.82,22.23 | 70.8,10.48 70.8,6.67 70.17,6.03 69.22,6.03 | 53.02,24.13 47.62,24.13 | 47.62,24.13 43.81,24.13 | C2.- 52.98,24.17 53.02,24.13 | 30.8,24.34 29.43,24.34 27.94,22.86 22.23,22.86 | S2.2 87,5.71 88.58,7.3 88.58,11.75 87.95,12.38 | C15.- 30.8,35.88 | RJ1.GND 22.23,22.86 | JP2.3 48.9,40.13 C16.2 | R24.2 26.22,48.13 26.04,48.32 | 83.82,22.23 85.72,22.23 | C6.2 64.45,21.59 63.02,23.02 | 63.02,23.02 58.1,27.94 48.9,27.94 47.62,26.67 47.62,24.13 | C22.- 30.8,26.99 | R42.1 43.81,22.86 | C12.2 C23.2 41.91,8.57 | 41.91,5.97 C17.- 41.05,5.11 C11.2 | U1.21 47.62,9.21 46.99,8.57 46.99,7.3 C24.2 46.67,6.67 47.84,5.5 C3.2 C4.2 C19.2 | C25.- 63.02,22.95 63.02,23.02 | 69.22,6.03 68.26,6.03 JP3.3 | LED1.C 69.12,5.93 69.22,6.03 | JP5.3 73.66,29.98 C26.2 72.52,42.99 v73.03,43.5 | 83.82,22.23 83.82,18.41
  Top 0.61: C18.- 12.38,40.01 12.38,42.55 13.02,43.18 14.29,43.18 | 43.81,13.02 47.31,13.02 47.62,12.7 U1.21 U1.22 | C21.- 26.04,48.32 26.06,47.81 24.45,46.2 24.45,43.18 | 14.29,43.18 24.45,43.18 | 24.45,43.18 26.99,43.18 28.26,41.91 28.26,39.37 29.62,38.01 IC6.1 30.59,37.24 C15.- | 30.8,35.88 30.8,26.99 30.8,24.34 C1.2 35.24,25.08 36.2,26.04 41.91,26.04 43.81,24.13 43.81,22.86 U1.11 U1.18 43.81,9.53 C12.2 | 41.91,8.57 41.91,7.62 41.91,5.97 | U$6.4 12.8,48.16 13.02,47.94 C20.2 13.02,46.67 14.16,45.53 D3.A 14.16,43.31 14.29,43.18 | C27.2 13.02,31.43 J1.2
  Top 0.813: J1.3 10.02,28.79 J1.2 13.02,38.73 C18.-
  Bottom 0.406: 76.83,39.37 IN1.8 76.83,42.55 69.85,49.53 69.85,53.02 73.03,56.2 73.03,62.23 73.34,62.55 SV2.2 SV2.4 SV2.6 SV2.8 SV2.10 SV2.12 SV2.14 SV2.16 | 76.83,39.37 82.55,39.37 83.19,40.01 IN1.3 IN1.2 IN1.1 | 76.83,39.37 76.52,39.37 75.25,38.1 | 75.25,38.1 65.09,38.1 | 65.09,38.1 60.64,38.1 | 42.23,28.26 50.48,28.26 54.29,32.07 | 42.23,28.26 34.61,28.26 | 34.61,28.26 29.21,28.26 | 42.23,28.26 OUT1.2 OUT1.3 | OUT1.8 34.61,28.26 | 60.64,38.1 58.74,40.01 IN0.8 58.74,42.23 46.67,54.29 46.67,60.96 48.26,62.55 SV3.2 SV3.4 SV3.6 SV3.8 SV3.10 SV3.12 SV3.14 SV3.16 | IN0.3 65.09,38.1 | 11.11,38.9 11.19,38.82 OUT0.8 17.46,31.11 18.1,30.48 23.81,30.48 | OUT0.3 23.81,30.48 | OUT0.1 26.35,30.48 | 26.35,30.48 23.81,30.48 | v87.95,18.1 88.24,18.44 C10.- | 26.35,30.48 26.99,30.48 28.57,28.89 29.21,28.26 | 29.21,28.26 29.21,28.25 | 60.64,38.1 54.29,32.07 | v77.47,8.57 77.49,8.26 C8.- | JP2.3 48.9,37.47 54.29,32.07 | 75.25,38.1 75.25,41.59 73.34,43.5 v73.03,43.5
  Bottom 0.813: 11.11,38.9 IC9.9 11.11,46.67 11.75,47.31 27.62,47.31 28.26,46.67 IC8.9 | C18.- 11.19,38.82
INT  (via drill 0.6 pad 1.78)
  Top 0.305: IC1.19 74.05,22.79
  Top 0.406: 74.05,22.79 72.23,24.61 67.15,24.61 66.36,25.4 66.36,53.66 v66.04,53.98
  Bottom 0.406: IN1.13 81.92,51.44 82.55,52.07 89.53,52.07 89.75,52.28 | 89.75,52.28 90.81,53.34 93.98,53.34 94.61,53.98 94.61,63.82 93.34,65.09 71.28,65.09 69.53,63.34 69.53,60.64 67.63,58.74 67.63,55.56 v66.04,53.98 65.41,53.98 63.82,52.39 IN0.13 63.82,50.16 | R43.2 89.75,52.28
INT_ETH  (1 unrouted)
  Top 0.305: IC1.25 60.59,18.62 58.9,20.32 | U1.4 52.7,21.59 52.07,22.23 50.16,22.23 49.53,22.86
  Top 0.406: 58.9,20.32 58.9,25.72 57.63,26.99 51.12,26.99 49.21,25.08
IPK
  Top 0.406: U$6.7 U$6.8 U$6.1 12.7,53.44
  Top 0.61: R26.2 12.7,53.44
  Top 0.813: R25.2 R27.2 R26.2
IR
  Top 0.305: IC1.17 75.05,23.06 74.93,23.18
  Top 0.406: JP5.2 71.12,26.99 | 71.12,26.99 74.93,23.18 | R45.2 70.7,26.57 71.12,26.99
LED
  Top 0.305: IC1.38 72.05,10.51 74.3,8.26 74.3,4.82 R38.2
LED2
  Top 0.305: IC1.39 72.55,10.8 75.25,8.1 75.25,6.67 75.98,5.93 R46.2
LED_G
  Top 0.406: R28.1 59.05,2.22 58.58,1.75 12.73,1.75 RJ1.G+ 8.32,6.03 7.94,6.03
LED_Y
  Top 0.406: R29.1 56.68,3.02 56.2,2.54 13.65,2.54 10.16,6.03 10.16,17.53 RJ1.Y+
MISO
  Top 0.305: U1.6 50.16,18.1 51.27,16.99 59.32,16.99 59.95,17.62 IC1.27
MOSI
  Top 0.305: U1.7 48.9,18.1 50.5,16.49 59.63,16.49 60.27,17.12 IC1.28
N$1
  Bottom 0.406: IC8.18 38.42,55.56 42.23,59.37 SV4.15
N$2
  Bottom 0.406: IN1.5 80.64,42.55 73.98,49.21 73.98,51.44 79.38,56.83 RN1.4 SV2.5
N$3
  Bottom 0.406: IN1.6 79.38,42.55 73.03,48.9 73.03,53.02 76.83,56.83 RN1.3 SV2.3
N$4
  Bottom 0.406: IN1.7 78.11,42.55 71.44,49.21 71.44,53.02 74.3,55.88 RN1.2 SV2.1
N$5
  Bottom 0.406: IN1.11 79.38,51.44 81.44,53.66 86.2,53.66 89.53,56.83 RN1.8 SV2.13
N$6
  Bottom 0.406: IN1.12 80.64,51.44 82.07,53.02 87.15,53.02 89.22,54.93 90.17,54.93 92.08,56.83 RN1.9 SV2.15
N$7
  Bottom 0.406: IN1.10 78.11,51.44 80.96,54.29 84.45,54.29 87,56.83 RN1.7 SV2.11
N$8
  Bottom 0.406: IN1.9 76.83,51.44 80.33,54.93 83.19,54.93 84.45,56.2 RN1.6 SV2.9
N$9
  Bottom 0.406: IN0.12 62.55,53.02 66.36,56.83 RN2.2 SV3.15
N$10
  Bottom 0.406: IN0.11 61.28,53.66 63.82,56.2 RN2.3 SV3.13
N$11
  Bottom 0.406: IN0.10 60.01,54.61 61.28,55.88 RN2.4 SV3.11
N$12
  Bottom 0.406: IN0.9 RN2.5 SV3.9
N$13
  Bottom 0.406: IN0.7 60.01,42.23 48.58,53.66 RN2.9 SV3.1
N$14
  Bottom 0.406: IN1.4 81.92,42.55 75.25,49.21 75.25,51.12 79.69,55.56 80.64,55.56 81.6,56.52 RN1.5 SV2.7
N$15
  Bottom 0.406: IC8.17 37.15,56.83 39.69,59.37 SV4.13
N$16
  Bottom 0.406: IN0.4 63.82,42.23 56.2,49.85 RN2.6 SV3.7
N$17
  Bottom 0.406: IC8.5 33.34,40.64 34.29,39.69 35.24,39.69 39.69,35.24 OUT1.4
N$18
  Bottom 0.406: IC8.6 32.07,40.32 33.66,38.73 34.92,38.73 38.42,35.24 OUT1.5
N$19
  Bottom 0.406: IC8.7 30.8,40.01 33.02,37.78 34.61,37.78 37.15,35.24 OUT1.6
N$20
  Bottom 0.406: IC8.8 29.53,39.69 32.38,36.83 34.29,36.83 35.88,35.24 OUT1.7
N$21
  Bottom 0.406: OUT1.9 IC8.4
N$22
  Bottom 0.406: OUT1.10 IC8.3
N$23
  Bottom 0.406: OUT1.11 IC8.2
N$24
  Bottom 0.406: OUT1.12 IC8.1
N$25
  Bottom 0.406: IC8.16 35.88,58.1 37.15,59.37 SV4.11
N$26
  Bottom 0.406: IN0.5 62.55,42.23 53.66,51.12 RN2.7 SV3.5
N$27
  Bottom 0.406: IN0.6 61.28,42.23 51.12,52.39 RN2.8 SV3.3
N$28
  Bottom 0.406: IC8.15 SV4.9
N$29
  Bottom 0.406: IC8.14 33.34,58.1 32.07,59.37 SV4.7
N$30
  Bottom 0.406: IC8.13 32.07,56.83 29.53,59.37 SV4.5
N$31
  Bottom 0.406: IC8.12 30.8,55.72 26.99,59.53 SV4.3
N$32
  Bottom 0.406: IC8.11 29.53,55.88 27.94,57.47 26.04,57.47 24.45,59.05 SV4.1
N$33
  Bottom 0.406: IC9.1 OUT0.12
N$34
  Bottom 0.406: IC9.2 OUT0.11
N$35
  Bottom 0.406: IC9.3 OUT0.10
N$36
  Bottom 0.406: IC9.4 OUT0.9
N$37
  Bottom 0.406: IC9.8 12.38,40.01 15.56,36.83 17.14,36.83 18.73,35.24 OUT0.7
N$38
  Bottom 0.406: IC9.7 13.65,40.32 16.19,37.78 17.46,37.78 20,35.24 OUT0.6
N$39
  Bottom 0.406: IC9.6 14.92,40.64 16.83,38.73 17.78,38.73 21.27,35.24 OUT0.5
N$40
  Bottom 0.406: IC9.5 16.19,40.64 17.14,39.69 18.1,39.69 22.54,35.24 OUT0.4
N$41
  Bottom 0.406: IC9.11 12.38,55.72 11.75,56.36 8.57,56.36 6.83,58.1 5.4,58.1 4.13,59.37 SV5.1
N$42
  Bottom 0.406: IC9.12 13.65,55.72 12.22,57.15 8.89,57.15 6.67,59.37 SV5.3
N$43
  Bottom 0.406: IC9.13 14.92,55.56 12.54,57.94 10.64,57.94 8.89,59.69 SV5.5
N$44
  Bottom 0.406: IC9.14 16.19,55.88 13.97,58.1 13.34,58.1 12.06,59.37 SV5.7
N$45
  Bottom 0.406: IC9.15 17.46,56.2 14.29,59.37 SV5.9
N$46
  Bottom 0.406: IC9.16 18.73,57.47 16.83,59.37 SV5.11
N$47
  Bottom 0.406: IC9.17 20,59.37 SV5.13
N$48
  Bottom 0.406: IC9.18 21.27,59.37 SV5.15
N$49
  Top 0.406: RJ1.P4 17.14,12.06 16.51,11.43 16.51,7.3 17.78,6.03 26.35,6.03 30.16,9.84 | C11.1 37.88,7.94 37.47,8.36 R20.2 R14.2 34.67,11.53 R19.2 R13.2 32.07,11.75 30.16,9.84 | R17.1 30.16,9.84
N$50
  Top 0.406: U1.14 39.1,21.38 R18.2
N$51
  Top 0.61: U$6.2 14.29,52.07 16.83,49.53 16.83,47.94 18.86,45.91 D3.C 20,46.35 L1.1
N$52
  Top 0.406: U1.1 56.52,23.21 C2.+
N$53
  Top 0.406: U1.23 50.16,7.83 C3.1 48.36,7.2 Q1.2
N$54
  Top 0.406: U1.27 55.24,10.32 59.05,6.51 R28.2
N$55
  Top 0.406: R48.2 U1.24
N$56
  Top 0.406: U$6.3 13.97,50.8 14.92,49.85 C20.1
N$57
  Top 0.61: C27.1 5.08,31.43
  Top 0.813: J1.1 15.24,27.3 11.43,23.5 8.57,23.5 5.08,26.99 5.08,31.43 F1.1A 8.95,34.04 C18.+
N$58
  Top 0.406: U1.26 53.98,10.32 56.83,7.46 R29.2
N$59  (via drill 0.6 pad 1.78)  (1 unrouted)
  Top 0.406: 85.86,31.43 R30.1 84.16,31.11 X1.D+ | 83.5,30.48 83.5,31.11 81.92,32.7 v78.42,32.7
  Bottom 0.406: R31.2 55.88,28.57 58.74,31.43 76.52,31.43 77.79,32.7 v78.42,32.7
N$60  (via drill 0.6 pad 1.78)
  Top 0.406: 79.06,30.48 78.96,30.48 | 78.96,30.48 X1.D- | v78.42,30.48 78.96,30.48
  Bottom 0.406: R32.2 58.42,29.84 59.05,30.48 v78.42,30.48
  cutout Top: 57.15,12.06 39.37,12.06 39.37,19.68 57.15,19.68
N$61
  Top 0.305: IC1.5 79.81,15.12 Q2.2 C13.1
  cutout Top: 23.18,6.35 18.41,6.35 18.41,18.1 23.18,18.1
N$62
  Top 0.305: Q2.1 C14.1
  Top 0.406: C14.1 85.41,15.14 R49.1
  cutout Bottom: 82.23,6.35 79.69,6.35 79.69,8.26 82.23,8.26
N$63
  Top 0.406: RJ1.P5 20.95,14.61 20.95,15.56 21.27,15.88 23.18,15.88 26.14,18.84 R40.1
N$64
  Top 0.305: 76,7.5 76,8.14 75.05,9.09 IC1.44
  Top 0.406: 76,7.5 76.52,6.99 78.11,6.99 79.06,6.04 R34.1 80.64,4.76 JP1.2
N$65
  Top 0.406: R38.1 LED1.A
N$66
  Top 0.406: C1.1 R21.1 R15.1 32.64,21.49 R22.1 R16.1 28.05,21.49 R40.2
N$67
  Top 0.406: R18.1 37.47,24.34 R41.1
N$68
  Top 0.406: R41.2 39.27,23.07 R42.2
N$69
  Top 0.305: R46.1 77.69,3.28 LED2.A
N$70
  Bottom 0.406: 70.8,11.43 79.38,11.43
N$71
  pour Top (isolate 0.406, rank 2): 2.22,65.09 94.61,65.09 94.61,1.59 2.22,1.59
N$72
  cutout Top: 70.8,19.37 77.79,19.37 77.79,12.38 70.8,12.38
N$73
  cutout Bottom: 5.4,20.95 24.13,20.95 24.13,4.45 5.4,4.45
N$74
  cutout Bottom: 80.01,35.56 94.3,35.56 94.3,22.86 80.01,22.86
N$75
  cutout Bottom: 10.16,53.98 22.23,53.98 21.59,46.04 10.16,46.04
  cutout Bottom: 27.3,53.66 39.37,53.66 39.37,45.72 27.3,45.72
  cutout Bottom: 57.78,49.53 69.85,49.53 69.85,41.59 57.78,41.59
  cutout Bottom: 75.88,49.53 87.95,49.53 87.95,41.59 75.88,41.59
  cutout Bottom: 33.66,40.96 44.45,40.96 44.45,33.02 33.66,33.02
  cutout Bottom: 16.51,40.96 27.3,40.96 27.3,33.02 16.51,33.02
N$76
  pour Bottom (isolate 0.406): 2.22,65.09 94.61,65.09 94.61,1.59 2.22,1.59
N$77
  cutout Bottom: 3.17,63.5 43.18,63.5 43.18,59.37 3.17,59.37
  cutout Bottom: 47.62,63.5 67.31,63.5 67.31,59.37 47.62,59.37
  cutout Bottom: 73.34,63.5 93.03,63.5 93.03,59.37 73.34,59.37
N$78
  cutout Top: 3.17,63.5 43.18,63.5 43.18,59.37 3.17,59.37
N$79
  cutout Top: 47.62,63.5 67.31,63.5 67.31,59.37 47.62,59.37
N$80
  cutout Top: 73.03,63.5 93.03,63.5 93.03,59.37 73.03,59.37
N$81
  cutout Top: 13.65,53.98 17.78,53.98 17.78,48.9 13.65,48.9
N$82
  cutout Top: 26.35,43.81 30.16,43.81 30.16,36.83 26.35,36.83
N$83
  Top 0.305: IC1.6 82.72,15.62 R49.2
N$84
  Top 0.406: Q1.1 52.17,7.3 C4.1 51.96,7.2 R48.1
N$85
  cutout Top: 15.24,46.67 17.78,46.67 17.78,43.81 15.24,43.81
OW  (via drill 0.6 pad 1.78)
  Top 0.305: IC1.12 78.48,21.64 v78.42,22.23
  Top 0.406: JP2.2 51.44,36.62 R39.2 52.17,34.82 57.47,29.53 59.05,29.53 60.01,28.57 v60.33,28.57
  Bottom 0.406: v78.42,22.23 78.42,21.59 66.36,21.59 60.33,27.62 v60.33,28.57
RESET
  Top 0.305: U1.10 45.09,18.1 49.21,13.97 56.52,13.97 58.52,11.96 R37.2
RST1
  Top 0.305: IC1.7 77.4,16.12 77.15,15.88 77.15,13.02 77.79,12.38
  Top 0.406: 77.79,12.38 82.87,12.38 83.5,11.75 83.5,9.53 | 83.5,9.53 R33.2 | S2.1 83.58,9.6 83.5,9.53
RX
  Top 0.305: IC1.31 62.62,15.62 61.91,14.92
  Top 0.406: 61.91,14.92 61.91,10.48 JP3.2
RX+
  Top 0.406: RJ1.RD+ 24.29,10.79 31.27,17.78 32.7,17.78 | 32.7,17.78 35.24,17.78 | 35.24,17.78 40.32,17.78 41.27,18.73 U1.13 | R15.2 32.7,17.78 | R21.2 35.24,17.78
RX-  (1 unrouted)
  Top 0.406: RJ1.RD- 22.54,14.92 24.29,14.92 28.73,19.37 29.84,19.37 | 29.84,19.37 31.43,19.37 | 31.43,19.37 37.15,19.37 37.47,19.05 | R16.2 29.84,19.37 | R22.2 31.75,19.68 31.43,19.37 | U1.12 42.55,18.73 40.32,16.51 37.78,16.51 37.47,16.83
SCK  (1 unrouted)
  Top 0.305: U1.8 47.62,18.1 50.16,15.56 58.42,15.56 58.42,15.88 | IC1.26 58.77,18.12 58.42,17.78
SCL  (via drill 0.6 pad 1.78)  (3 unrouted)
  Top 0.305: IC1.21 73.05,22.52
  Top 0.406: 73.05,22.52 71.75,23.81 65.72,23.81 64.77,24.77 v64.77,35.24
  Bottom 0.305: R36.2 51.12,25.4
  Bottom 0.406: IN1.14 83.19,46.35 86.68,42.86 86.68,39.69 86.36,39.37 83.82,39.37 82.87,38.42 76.83,38.42 74.93,36.51 74.93,35.56 74.61,35.24 71.12,35.24 | IN0.14 65.09,46.35 71.12,40.32 71.12,39.05 | 71.12,35.24 71.12,36.51 | OUT1.14 40.96,40.32 44.45,36.83 44.45,29.53 | 71.12,35.24 v64.77,35.24 58.74,35.24 52.39,28.89 52.39,26.67 51.12,25.4 44.45,25.4 | 44.45,25.4 31.75,25.4 30.8,26.35 | 44.45,25.4 44.45,26.67 | OUT0.14 23.81,40.32 30.8,33.34 30.8,29.53
SDA  (via drill 0.6 pad 1.78)  (4 unrouted)
  Top 0.305: IC1.22 72.55,21.91 71.44,23.02
  Top 0.406: 71.44,23.02 64.77,23.02 62.55,25.24 v62.55,33.81
  Bottom 0.305: R35.2 48.9,24.45
  Bottom 0.406: IN1.15 84.45,46.35 87.63,43.18 87.63,39.37 86.68,38.42 84.14,38.42 83.19,37.47 77.15,37.47 75.88,36.2 75.88,34.92 75.25,34.29 73.34,34.29 | IN0.15 66.36,48.9 67.94,47.31 67.94,45.4 73.34,40.01 73.34,39.05 | 73.34,34.29 73.34,33.34 | OUT1.15 42.23,40.32 46.67,35.88 46.67,29.53 | 73.34,34.29 72.87,33.81 v62.55,33.81 58.58,33.81 53.66,28.89 53.66,25.4 52.7,24.45 48.9,24.45 41.91,24.45 | OUT0.15 25.08,40.32 33.02,32.38 33.02,29.84 | 32.86,26.67 41.91,26.67
SWCLK
  Top 0.305: IC1.37 71.55,8.46 JP6.1
SWDIO
  Top 0.305: IC1.34 66.51,14.12 66.36,13.97
  Top 0.406: 66.36,13.97 66.36,10.48 66.67,10.16 67.31,10.16 JP6.2
TX
  Top 0.305: IC1.30 62.16,16.12 60.96,14.92
  Top 0.406: 60.96,14.92 JP3.1
TX+
  Top 0.406: RJ1.TD+ 24.29,8.26 30.96,14.92 33.02,14.92 | 33.02,14.92 33.66,14.92 | 33.66,14.92 40.32,14.92 42.55,12.7 U1.17 | R13.1 33.02,14.92 | R19.1 33.81,15.07 33.66,14.92
TX-
  Top 0.406: RJ1.TD- 18.1,9.53 17.78,9.21 17.78,7.3 18.1,6.99 24.29,6.99 30.96,13.65 35.88,13.65 | 35.88,13.65 37.47,13.65 | 37.47,13.65 40.32,13.65 41.27,12.7 U1.16 | R14.1 35.88,13.65 | R20.1 37.47,13.65
VBUS
  Top 0.406: X1.VBUS 81.52,28.82 81.92,29.21 85.41,29.21 R30.2
VCC  (via drill 0.6 pad 1.78)  (5 unrouted)
  Top 0.305: IC1.9 79.51,17.12 79.85,17.46 79.85,17.94 80.64,18.73 C9.1 79.69,20 v80.01,20 | IC1.36 69.53,13.12 69.22,12.81 v69.22,11.27 | IC1.48 79.75,11.69 80.33,11.11 80.33,10.16 | IC1.24 71.49,20 v69.85,20 67.63,20 C6.1
  Top 0.406: 33.34,45.09 v40.96,45.09 46.04,45.09 | U1.15 C23.1 | C23.1 40.01,7.3 39.22,6.52 36.2,6.52 | C7.1 68.89,11.75 v69.22,11.27 | 83.19,6.03 83.19,4.13 JP1.1 | R33.1 81.28,7.94 | 25.08,40.25 IC6.4 | C15.+ 26.99,35.88 | IC6.2 32.38,40.32 | R39.1 53.98,35.98 JP2.1 53.98,40.13 C16.1 52.84,42.41 50.16,45.09 46.04,45.09 | 26.04,26.99 C22.+ | U1.25 52.7,10.16 | C23.1 | 45.09,9.52 C12.1 | U1.20 46.35,10.16 | 45.08,7.93 C24.1 | 36.2,6.52 36.2,4.12 36.51,3.81 42.23,3.81 43.18,4.76 43.18,5.46 C17.+ | 53.98,4.45 C19.1 | R17.2 35.56,7.16 36.2,6.52 | U1.28 57.53,10.26 R37.1 | 46.04,45.09 JP4.2 JP4.3 | JP4.1 46.04,45.09 | v81.92,10.79 81.59,10.79 C5.1 | 28.76,54.93 R23.1
  Top 0.61: U1.25 52.7,12.7 53.02,13.02 56.2,13.02 56.52,12.7 U1.28 | 80.33,10.16 C5.1 81.28,9.21 81.28,7.94 83.19,6.03 | 25.08,40.25 25.08,35.88 26.99,35.88 | 26.04,26.99 26.04,34.08 C15.+ | 52.7,10.16 55.24,7.62 55.24,6.03 54.29,5.08 C19.1 | U1.19 45.09,9.52 | 46.35,10.16 C12.1 45.08,7.93 | 53.98,4.45 53.02,3.49 45.66,3.49 C17.+ 43.5,6.03 C24.1 | L1.2 26.04,54.93 | 26.04,54.93 28.76,54.93 | C21.+ 26.04,54.93
  Bottom 0.305: 64.77,52.07 64.45,51.75 64.45,46.99 | 39.37,43.5 39.05,43.18 39.05,38.1 | 23.81,43.5 23.5,43.5 23.18,43.18 23.18,39.69 | R36.1 51.12,22.86 51.44,22.54 | R35.1 48.9,22.54
  Bottom 0.406: IN0.1 IN0.2 66.36,43.81 64.45,45.72 64.45,46.99 | IN0.16 67.63,51.44 | 67.63,51.44 68.9,52.7 RN2.1 70.48,57.47 | 70.48,57.47 RN1.1 | 67.63,51.44 66.99,52.07 64.77,52.07 | 70.48,57.47 70.48,62.87 71.75,64.14 92.71,64.14 93.66,63.18 93.66,55.56 92.71,54.61 | OUT1.16 43.5,43.18 43.18,43.5 40.96,43.5 | 40.96,43.5 39.37,43.5 | 39.05,38.1 43.5,33.66 OUT1.1 | OUT0.16 26.35,43.5 | 26.35,43.5 23.81,43.5 | 23.18,39.69 23.18,35.88 25.08,33.97 OUT0.2 | 26.35,43.5 v26.35,45.09 | v40.96,45.09 40.96,43.5 | 90.17,50.32 IN1.16 85.72,46.35 88.58,43.81 88.58,39.05 87,37.47 84.45,37.47 83.5,36.51 77.47,36.51 76.83,35.88 76.83,34.61 74.61,32.38 58.42,32.38 54.61,28.57 54.61,24.77 52.07,22.54 51.44,22.54 | 90.17,50.32 90.96,50.32 92.71,52.07 | C10.+ 79.03,19.98 v80.01,20 | 48.9,22.54 49.53,22.54 | C8.+ 83.16,9.23 v81.92,10.79 | R35.1 43.65,22.33 | 43.65,5.93 C17.+ | R43.1 89.91,50.59 90.17,50.32 | C25.+ 62.23,20
  Bottom 0.61: v69.85,20 v80.01,20 78.74,20 78.74,13.65 81.6,10.79 v81.92,10.79 | v69.85,20 69.85,12.06 v69.22,11.27 | 49.53,22.54 51.44,22.54 53.98,20 62.23,20 v69.85,20 | 43.65,5.93 43.65,22.33 30.7,22.33 27.05,25.97 C22.+
  pour Top (isolate 0.406, no thermals): 13.97,42.23 23.81,42.23 24.13,41.91 26.04,41.91 26.04,35.24 22.86,32.07 16.51,32.07 16.51,33.34 13.97,33.34
VCC_5V
  Top 0.406: 31.43,52.7 41.59,52.7 | 41.59,52.7 61.91,52.7 64.77,55.56 67.63,55.56 68.9,54.29 68.9,31.11 | 68.9,31.11 68.9,28.57 JP5.1 69,27.84 R45.1 | C26.1 68.9,31.11 | JP7.2 JP7.1 41.59,52.7
  Top 0.61: 28.76,55.38 31.43,52.7 31.43,42.71 IC6.3
VCC_12V  (via drill 0.6 pad 1.78)
  Top 0.61: D2.A 9.21,43.5 5.08,47.62 F1.2A
  Top 0.813: SV4.16 SV5.2 3.17,62.55 2.54,61.91 2.54,57.78 v3.17,57.15 4.7,57.15 5.08,56.77 F1.2A
  Bottom 0.813: SV4.16 SV4.14 | SV4.14 39.37,62.55 | SV4.14 SV4.12 SV4.10 SV4.8 SV4.6 SV4.4 SV4.2 SV5.16 SV5.14 SV5.12 SV5.10 SV5.8 SV5.6 SV5.4 SV5.2 3.17,62.55 2.54,61.91 2.54,57.78 v3.17,57.15
VCC_12V_D
  Top 0.406: R27.1 R26.1 | U$6.6 20,50.8 20.64,51.44 20.64,54.29 18.1,56.83 R25.1
  Top 0.61: D2.C 9.53,54.61 11.75,56.83 R26.1
  Top 0.813: R27.1 R25.1
(copper drawn outside any net)
  shapes: Bottom area x40, Bottom circle x4, Top area x61, Top circle x5

### Text on the board
Top: piny do ustawień | pcfy na 5v? | gniazda fajne | ceramik na wejscie
Bottom: 5V | 3v3 | GND | OW | 3v3 | 5V | IR | G | TX | RX | G | SIO | SCK | B